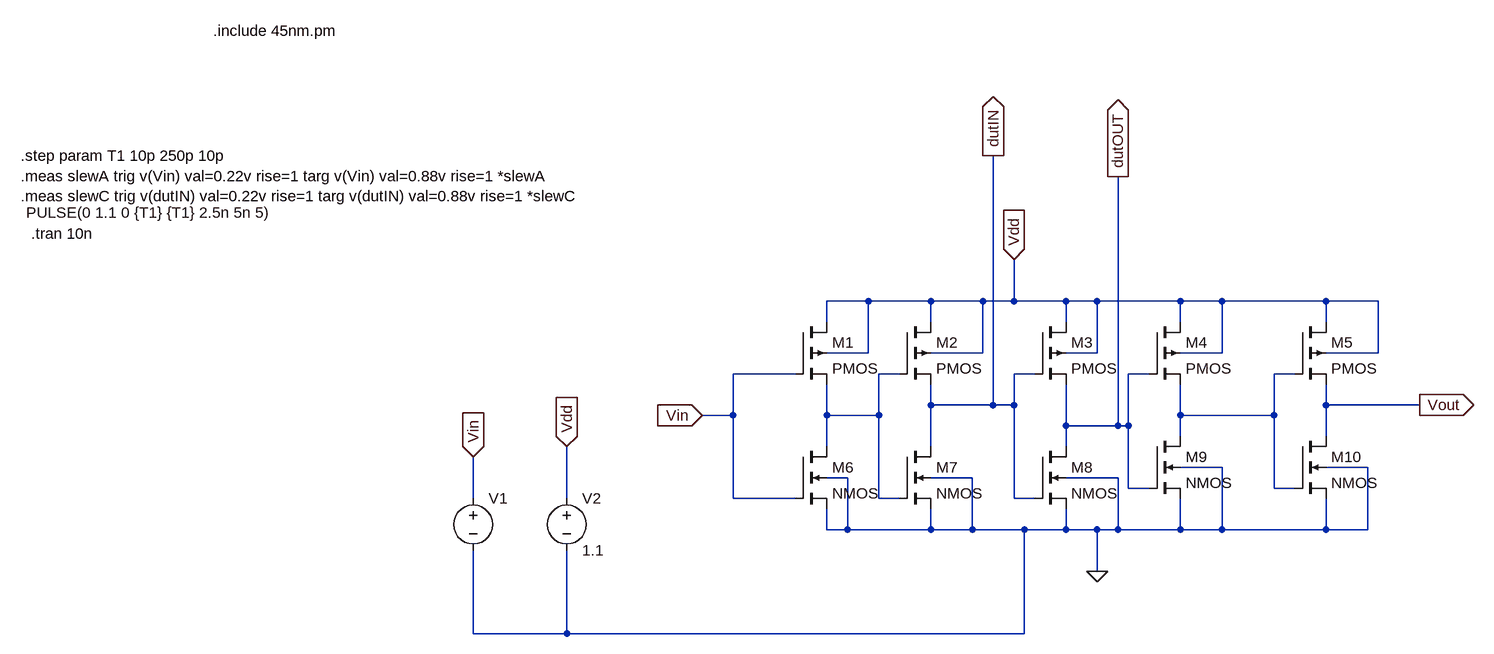
[diagram p0: schematic hw-2.asc]
hw-2.asc, the LTspice schematic file:
Version 4
SHEET 1 1280 680
WIRE 320 112 256 112
WIRE 416 112 320 112
WIRE 496 112 416 112
WIRE 544 112 544 48
WIRE 544 112 496 112
WIRE 624 112 544 112
WIRE 672 112 624 112
WIRE 800 112 672 112
WIRE 864 112 800 112
WIRE 1024 112 864 112
WIRE 1104 112 1024 112
WIRE 256 144 256 112
WIRE 416 144 416 112
WIRE 624 144 624 112
WIRE 800 144 800 112
WIRE 1024 144 1024 112
WIRE 320 192 320 112
WIRE 320 192 256 192
WIRE 496 192 496 112
WIRE 496 192 416 192
WIRE 672 192 672 112
WIRE 672 192 624 192
WIRE 864 192 864 112
WIRE 864 192 800 192
WIRE 1104 192 1104 112
WIRE 1104 192 1024 192
WIRE 208 224 112 224
WIRE 368 224 336 224
WIRE 576 224 544 224
WIRE 752 224 720 224
WIRE 976 224 944 224
WIRE 416 272 416 240
WIRE 512 272 512 -112
WIRE 512 272 416 272
WIRE 544 272 544 224
WIRE 544 272 512 272
WIRE 1024 272 1024 240
WIRE 1168 272 1024 272
WIRE 112 288 112 224
WIRE 112 288 64 288
WIRE 256 288 256 240
WIRE 336 288 336 224
WIRE 336 288 256 288
WIRE 800 288 800 240
WIRE 944 288 944 224
WIRE 944 288 800 288
WIRE 624 304 624 240
WIRE 704 304 704 -80
WIRE 704 304 624 304
WIRE 720 304 720 224
WIRE 720 304 704 304
WIRE 800 320 800 288
WIRE 1024 320 1024 272
WIRE 256 336 256 288
WIRE 416 336 416 272
WIRE 624 336 624 304
WIRE 864 368 800 368
WIRE 1088 368 1024 368
WIRE 288 384 256 384
WIRE 480 384 416 384
WIRE 704 384 624 384
WIRE 720 400 720 304
WIRE 752 400 720 400
WIRE 944 400 944 288
WIRE 976 400 944 400
WIRE -288 416 -288 352
WIRE -144 416 -144 336
WIRE 112 416 112 288
WIRE 208 416 112 416
WIRE 336 416 336 288
WIRE 368 416 336 416
WIRE 544 416 544 272
WIRE 576 416 544 416
WIRE 256 464 256 432
WIRE 288 464 288 384
WIRE 288 464 256 464
WIRE 416 464 416 432
WIRE 416 464 288 464
WIRE 480 464 480 384
WIRE 480 464 416 464
WIRE 560 464 480 464
WIRE 624 464 624 432
WIRE 624 464 560 464
WIRE 672 464 624 464
WIRE 704 464 704 384
WIRE 704 464 672 464
WIRE 800 464 800 416
WIRE 800 464 704 464
WIRE 864 464 864 368
WIRE 864 464 800 464
WIRE 1024 464 1024 416
WIRE 1024 464 864 464
WIRE 1088 464 1088 368
WIRE 1088 464 1024 464
WIRE 672 528 672 464
WIRE -288 624 -288 496
WIRE -144 624 -144 496
WIRE -144 624 -288 624
WIRE 560 624 560 464
WIRE 560 624 -144 624
FLAG 544 48 Vdd
IOPIN 544 48 In
FLAG 64 288 Vin
IOPIN 64 288 In
FLAG 672 528 0
FLAG 1168 272 Vout
IOPIN 1168 272 Out
FLAG -288 352 Vin
IOPIN -288 352 In
FLAG -144 336 Vdd
IOPIN -144 336 In
FLAG 512 -112 dutIN
IOPIN 512 -112 Out
FLAG 704 -80 dutOUT
IOPIN 704 -80 Out
SYMBOL pmos4 208 144 R0
SYMATTR InstName M1
SYMATTR Value2 l=45n w=0.296u
SYMBOL pmos4 368 144 R0
SYMATTR InstName M2
SYMATTR Value2 l=45n w=0.296u m=4
SYMBOL pmos4 576 144 R0
SYMATTR InstName M3
SYMATTR Value2 l=45n w=0.296u m=16
SYMBOL pmos4 752 144 R0
SYMATTR InstName M4
SYMATTR Value2 l=45n w=0.296u m=64
SYMBOL pmos4 976 144 R0
SYMATTR InstName M5
SYMATTR Value2 l=45n w=0.296u m=256
SYMBOL nmos4 208 336 R0
SYMATTR InstName M6
SYMATTR Value2 l=45n w=0.2u
SYMBOL nmos4 368 336 R0
SYMATTR InstName M7
SYMATTR Value2 l=45n w=0.2u m=4
SYMBOL nmos4 576 336 R0
SYMATTR InstName M8
SYMATTR Value2 l=45n w=0.2u m=16
SYMBOL nmos4 752 320 R0
SYMATTR InstName M9
SYMATTR Value2 l=45n w=0.2u m=64
SYMBOL nmos4 976 320 R0
SYMATTR InstName M10
SYMATTR Value2 l=45n w=0.2u m=256
SYMBOL voltage -288 400 R0
WINDOW 123 0 0 Left 0
WINDOW 39 0 0 Left 0
WINDOW 3 -688 -424 Left 2
SYMATTR Value PULSE(0 1.1 0 {T1} {T1} 2.5n 5n 5)
SYMATTR InstName V1
SYMBOL voltage -144 400 R0
WINDOW 123 0 0 Left 0
WINDOW 39 0 0 Left 0
SYMATTR InstName V2
SYMATTR Value 1.1
TEXT -688 -304 Left 2 !.include 45nm.pm
TEXT -984 -112 Left 2 !.step param T1 10p 250p 10p\n.meas slewA trig v(Vin) val=0.22v rise=1 targ v(Vin) val=0.88v rise=1 *slewA\n.meas slewC trig v(dutIN) val=0.22v rise=1 targ v(dutIN) val=0.88v rise=1 *slewC
TEXT -968 8 Left 2 !.tran 10n

The netlist it stands for:
* hw-2.asc
M1 Vdd Vin N001 Vdd PMOS l=45n w=0.296u
M2 Vdd N001 dutIN Vdd PMOS l=45n w=0.296u m=4
M3 Vdd dutIN dutOUT Vdd PMOS l=45n w=0.296u m=16
M4 Vdd dutOUT N002 Vdd PMOS l=45n w=0.296u m=64
M5 Vdd N002 Vout Vdd PMOS l=45n w=0.296u m=256
M6 N001 Vin 0 0 NMOS l=45n w=0.2u
M7 dutIN N001 0 0 NMOS l=45n w=0.2u m=4
M8 dutOUT dutIN 0 0 NMOS l=45n w=0.2u m=16
M9 N002 dutOUT 0 0 NMOS l=45n w=0.2u m=64
M10 Vout N002 0 0 NMOS l=45n w=0.2u m=256
V1 Vin 0 PULSE(0 1.1 0 {T1} {T1} 2.5n 5n 5)
V2 Vdd 0 1.1
.model NMOS NMOS
.model PMOS PMOS
.lib standard.mos
.include 45nm.pm
.step param T1 10p 250p 10p
.meas slewA trig v(Vin) val=0.22v rise=1 targ v(Vin) val=0.88v rise=1 *slewA
.meas slewC trig v(dutIN) val=0.22v rise=1 targ v(dutIN) val=0.88v rise=1 *slewC
.tran 10n
.backanno
.end